# EAGLE design KidMotorV1.1 (EAGLE 9.2.1)
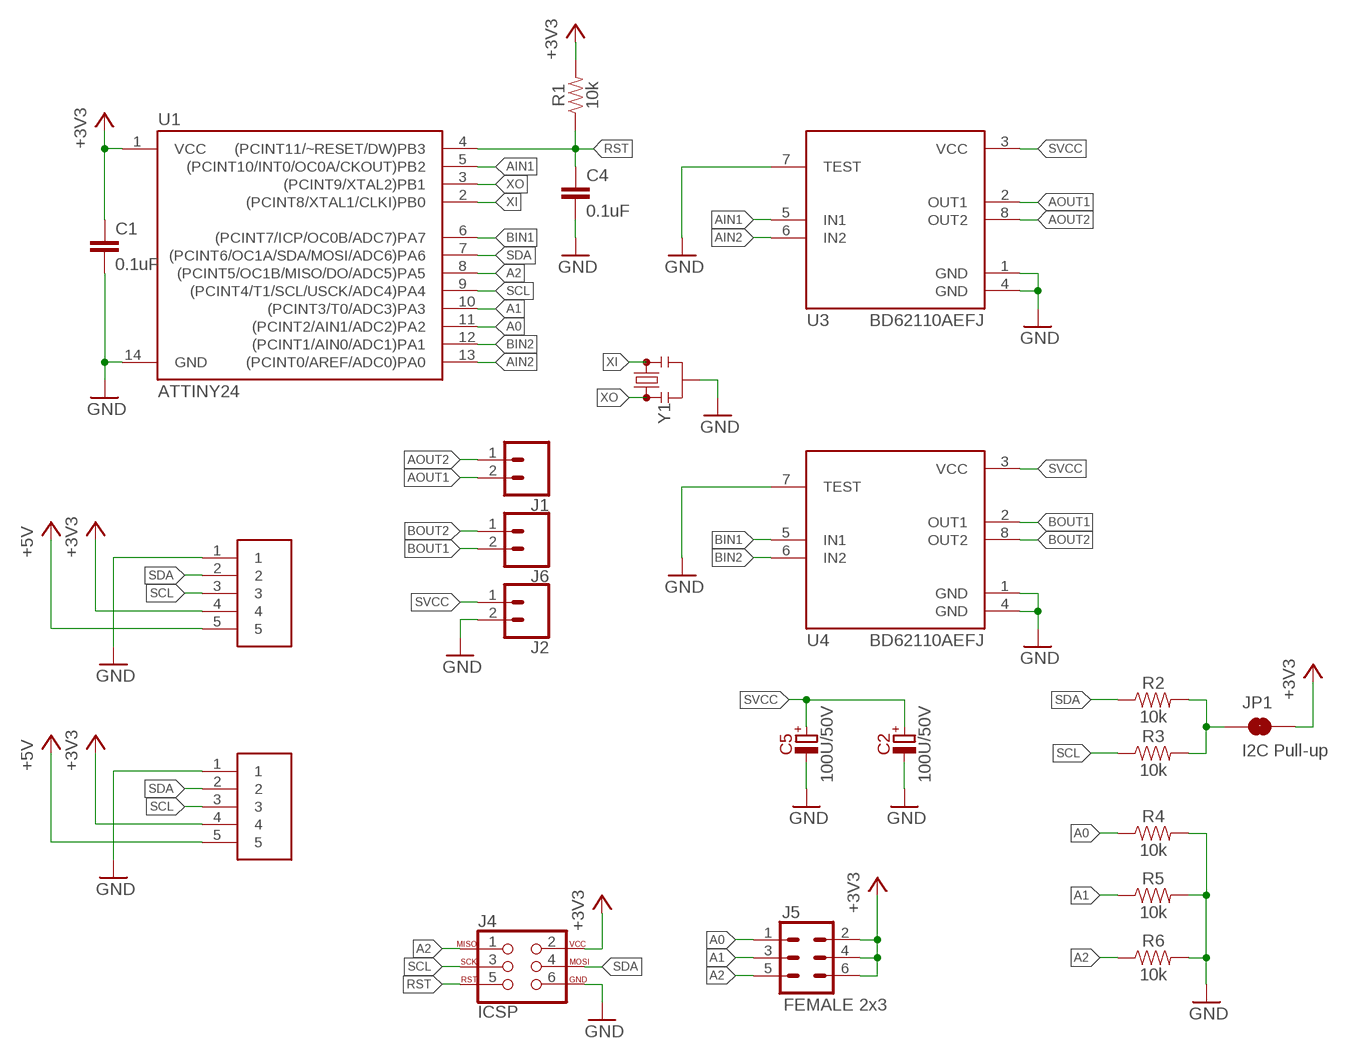
[diagram p0: schematic, sheet 1]

## Parts
C1  0.1uF  1.0UF-0603-16V-10%  [0603]
C2  100U/50V  [E3,5-8]
C4  0.1uF  0.1UF-0603-25V-5%  [0603]
C5  100U/50V  [E3,5-8]
J1  CONN_025MM  [SCREWTERMINAL-5MM-2]
J2  CONN_025MM  [SCREWTERMINAL-5MM-2]
J4  ICSP  AVR_SPI_PROG_3X2PTH  [2X3]
J5  FEMALE 2x3  CONN_03X2FEMALE  [2X3]
J6  CONN_025MM  [SCREWTERMINAL-5MM-2]
JP1  I2C Pull-up  JUMPER-SMT_2_NC_TRACE_SILK  [SMT-JUMPER_2_NC_TRACE_SILK]
R1  10k  10KOHM-0603-1/10W-1%  [0603]
R2  10k  10KOHM-0603-1/10W-1%  [0603]
R3  10k  10KOHM-0603-1/10W-1%  [0603]
R4  10k  10KOHM-0603-1/10W-1%  [0603]
R5  10k  10KOHM-0603-1/10W-1%  [0603]
R6  10k  10KOHM-0603-1/10W-1%  [0603]
U1  ATTINY24  ATTINY84  [SO14]
U3  BD62110AEFJ  [HTSOP-J8]
U4  BD62110AEFJ  [HTSOP-J8]
U$2  JST5PIN  [JST5PIN]
U$5  JST5PIN  [JST5PIN]
Y1  RESONATORSMD-3.2X1.3  [RESONATOR-SMD-3.2X1.3]

## Nets
+3V3: C1.1 J4.2 J5.2 J5.4 J5.6 JP1.2 R1.2 U1.1(VCC) U$2.4 U$5.4
+5V: U$2.5 U$5.5
A0: J5.1 R4.1 U1.11((PCINT2/AIN1/ADC2)PA2)
A1: J5.3 R5.1 U1.10((PCINT3/T0/ADC3)PA3)
A2: J4.1 J5.5 R6.1 U1.8((PCINT5/OC1B/MISO/DO/ADC5)PA5)
AIN1: U1.5((PCINT10/INT0/OC0A/CKOUT)PB2) U3.5(IN1)
AIN2: U1.13((PCINT0/AREF/ADC0)PA0) U3.6(IN2)
AOUT1: J1.2 U3.2(OUT1)
AOUT2: J1.1 U3.8(OUT2)
BIN1: U1.6((PCINT7/ICP/OC0B/ADC7)PA7) U4.5(IN1)
BIN2: U1.12((PCINT1/AIN0/ADC1)PA1) U4.6(IN2)
BOUT1: J6.2 U4.2(OUT1)
BOUT2: J6.1 U4.8(OUT2)
GND: C1.2 C2.- C4.2 C5.- J2.2 J4.6 R4.2 R5.2 R6.2 U1.14(GND) U3.1(GND) U3.4(GND) U3.7(TEST) U4.1(GND) U4.4(GND) U4.7(TEST) U$2.1 U$5.1 Y1.2
N$2: JP1.1 R2.2 R3.2
RST: C4.1 J4.5 R1.1 U1.4((PCINT11/~RESET/DW)PB3)
SCL: J4.3 R3.1 U1.9((PCINT4/T1/SCL/USCK/ADC4)PA4) U$2.3 U$5.3
SDA: J4.4 R2.1 U1.7((PCINT6/OC1A/SDA/MOSI/ADC6)PA6) U$2.2 U$5.2
SVCC: C2.+ C5.+ J2.1 U3.3(VCC) U4.3(VCC)
XI: U1.2((PCINT8/XTAL1/CLKI)PB0) Y1.3
XO: U1.3((PCINT9/XTAL2)PB1) Y1.1

## Library data of the parts
C1 = SparkFun-Capacitors:1.0UF: 1µF ceramic capacitors A capacitor is a passive two-terminal electrical component used to store electrical energy temporarily in an electric field.; PROD_ID: CAP-00868; VALUE: 1.0uF
C2 C5 = capacitors-electrolytic:?; MOUSER: 647-UKA1H101MPD
C4 = SparkFun-Capacitors:0.1UF: 0.1µF ceramic capacitors A capacitor is a passive two-terminal electrical component used to store electrical energy temporarily in an electric field.; PROD_ID: CAP-08604
J1 J2 J6 = SparkFun-Connectors:CONN_02: Multi connection point. Often used as Generic Header-pin footprint for 0.1 inch spaced/style header connections On any of the 0.1 inch spaced packages, you can populate with these: Break Away Headers - Straight <https://www.sparkfun.com/products/116> (PRT-00116) Break Away Male Headers - Right Angle <https://www.sparkfun.com/products/553> (PRT-00553) Female Headers <https://www.sparkfun.com/products/115> (PRT-00115) Break Away Headers - Machine Pin <https://www.sparkfun.com/products/117> (PRT-00117) Break Away Female Headers - Swiss Machine Pin <https://www.sparkfun.com/products/743> (PRT-00743) For SCREWTERMINALS and SPRING TERMINALS visit here: Screw Terimnals on SparkFun.com <https://www.sparkfun.com/search/results?term=Screw+Terminals> (5mm/3.5mm/2.54mm spacing) This device is also useful as a general connection point to wire up your design to another part of your project. Our various solder wires solder well into these plated through hole pads. Hook-Up Wire - Assortment (Stranded, 22 AWG) <https://www.sparkfun.com/products/11375> (PRT-11375) Hook-Up Wire - Assortment (Solid Core, 22 AWG) <https://www.sparkfun.com/products/11367> (PRT-11367) View the entire wire category on our website here <https://www.sparkfun.com/categories/141> Special notes: Molex polarized connector foot print use with: PRT-08233 with associated crimp pins and housings. 2.54_SCREWTERM for use with PRT-10571. 3.5mm Screw Terminal footprints for PRT-08084 5mm Screw Terminal footprints for use with PRT-08432; SF_SKU: PRT-08432
J4 = SparkFun-Connectors:AVR_SPI_PROG_3X2: AVR ISP 6 Pin This is the reduced ISP connector for AVR programming. Common on Arduino. This footprint will take up less PCB space and can be used with a 10-pin to 6-pin adapter such as SKU: BOB-08508 **Special note about "TEST_POINT" package. The stop mask is on the top side, so if you want your programming test points to be on the bottom of your board, make sure to place this package on the bottom side of the board. This also ensure that the orientation to program from the bottom side will be correct. SparkFun Products: SparkFun ISP Pogo Adapter <https://www.sparkfun.com/products/11591> - NS Tiny AVR Programmer <https://www.sparkfun.com/products/11801> -PTH
J5 = SparkFun-Connectors:CONN_03X2: Multi connection point. Often used as Generic Header-pin footprint for 0.1 inch spaced/style header connections You can populate with any combo of single row headers, but if you'd like an exact match, check these: Header - 2x3 (Male, 0.1") <https://www.sparkfun.com/products/12807> (PRT-12807) Header - 2x3 (Female, 0.1") <https://www.sparkfun.com/products/13010> (PRT-13010) 2x3 Pin Shrouded Header <https://www.sparkfun.com/products/10877> (PRT-10877) On any of the 0.1 inch spaced packages, you can populate with these: Break Away Headers - Straight <https://www.sparkfun.com/products/116> (PRT-00116) Break Away Male Headers - Right Angle <https://www.sparkfun.com/products/553> (PRT-00553) Female Headers <https://www.sparkfun.com/products/115> (PRT-00115) Break Away Headers - Machine Pin <https://www.sparkfun.com/products/117> (PRT-00117) Break Away Female Headers - Swiss Machine Pin <https://www.sparkfun.com/products/743> (PRT-00743) Special note: the shrouded connector mates well with our 3x2 ribbon cables: Ribbon Crimp Connector - 6-pin (2x3, Female) <https://www.sparkfun.com/products/10651> (PRT-10651) Ribbon Cable - 6 wire (15ft) <https://www.sparkfun.com/products/10646> (PRT-10646); PROD_ID: CONN-11566
JP1 = SparkFun-Jumpers:JUMPER-SMT_2_NC_TRACE: Normally closed trace jumper This jumper has a trace between two pads so it's normally closed (NC). Use a razor knife to open the connection. For best results follow the IPC guidelines for cutting traces: Cutout at least 0.063 mm (0.005 in). Remove all loose material to clean up the cut area. Seal the cut with an approved epoxy. Reapply solder to reclose the connection.
R1-R6 = SparkFun-Resistors:10KOHM: 10kΩ resistor A resistor is a passive two-terminal electrical component that implements electrical resistance as a circuit element. Resistors act to reduce current flow, and, at the same time, act to lower voltage levels within circuits. - Wikipedia; PROD_ID: RES-00824
U1 = SparkFun-IC-Microcontroller:ATTINY84: Atmel 14-pin 2/4/8kB flash uC Datasheet <https://cdn.sparkfun.com/datasheets/Widgets/doc8006.pdf> SparkFun Products Tiny AVR Programmer <https://www.sparkfun.com/products/11801> (PGM-11801) SparkFun Servo Trigger - Continuous Rotation <https://www.sparkfun.com/products/13872> (WIG-13872) SparkFun Servo Trigger <https://www.sparkfun.com/products/13118> (WIG-13118); PROD_ID: IC-11285; VALUE: ATTINY84
U3 U4 = IOXhop-IC:BD62110AEFJ
U$2 U$5 = IOXhop Connector:JST5PIN
Y1 = SparkFun-Clocks:RESONATOR: Resonators (Generic) Ceramic resonators are clock-generating components, often used to control timing in microcontrollers. They usually have 3 pins: two pins for oscillation, and one pin for ground. Compared to crystals, resonators have worse tolerance, but are usually much cheaper. Plus, they have built-in load capacitors! These devices are used on boards like the Arduino Pro 8MHz <https://www.sparkfun.com/products/11114> and Arduino Pro 16MHz <https://www.sparkfun.com/products/11113>.

## Board
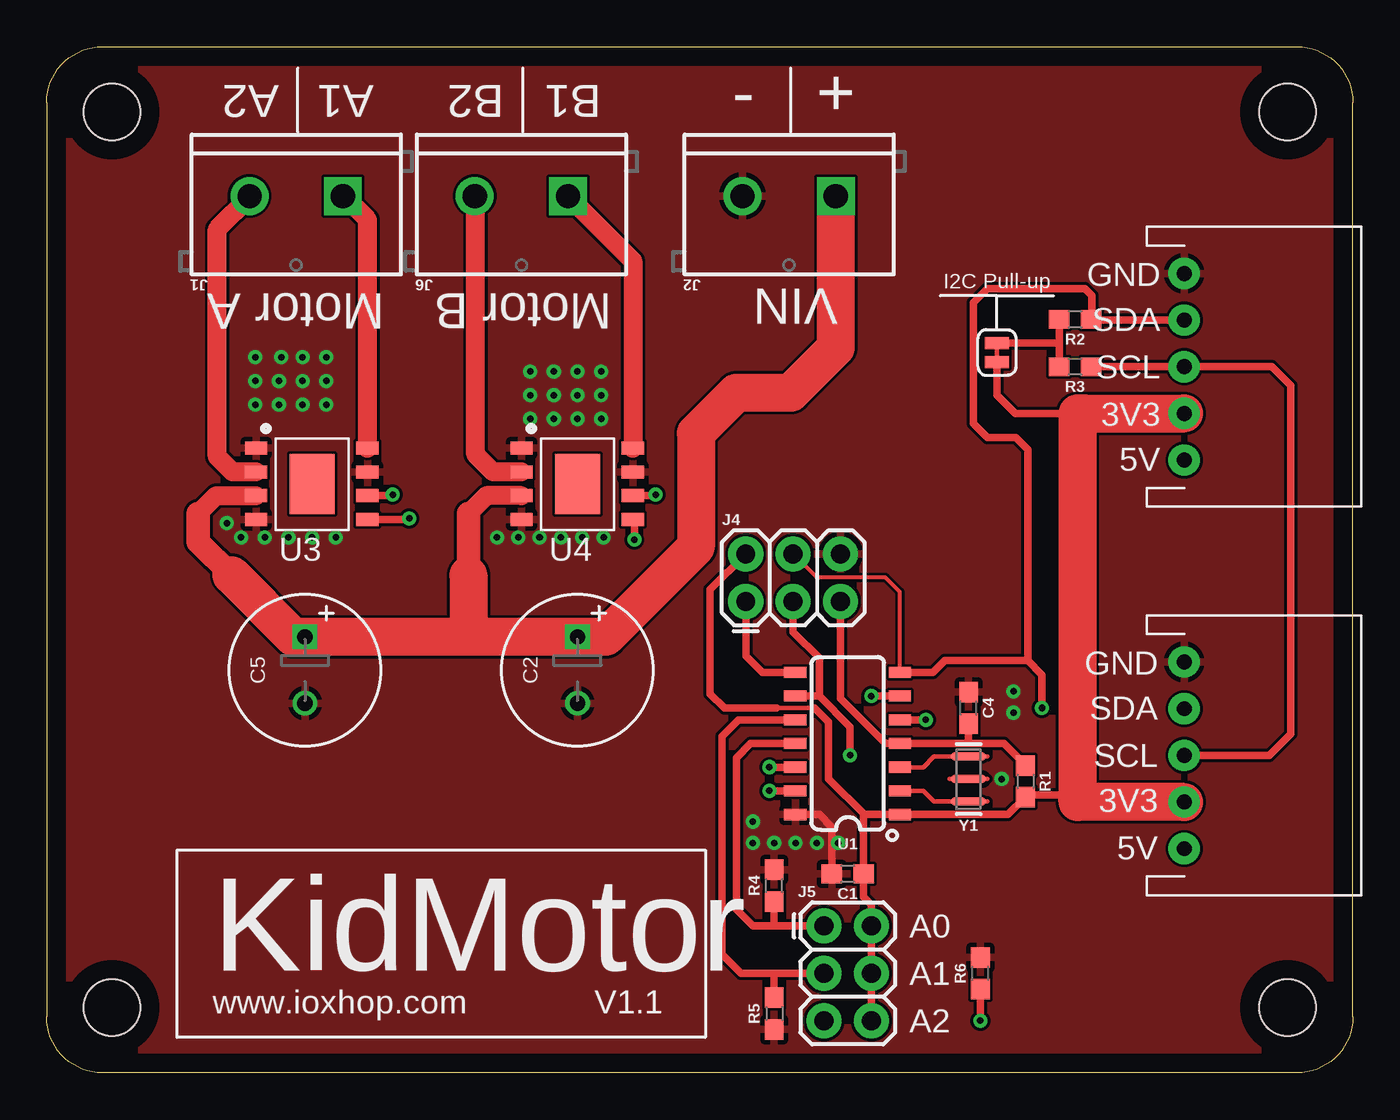
[diagram p1: board, top side]
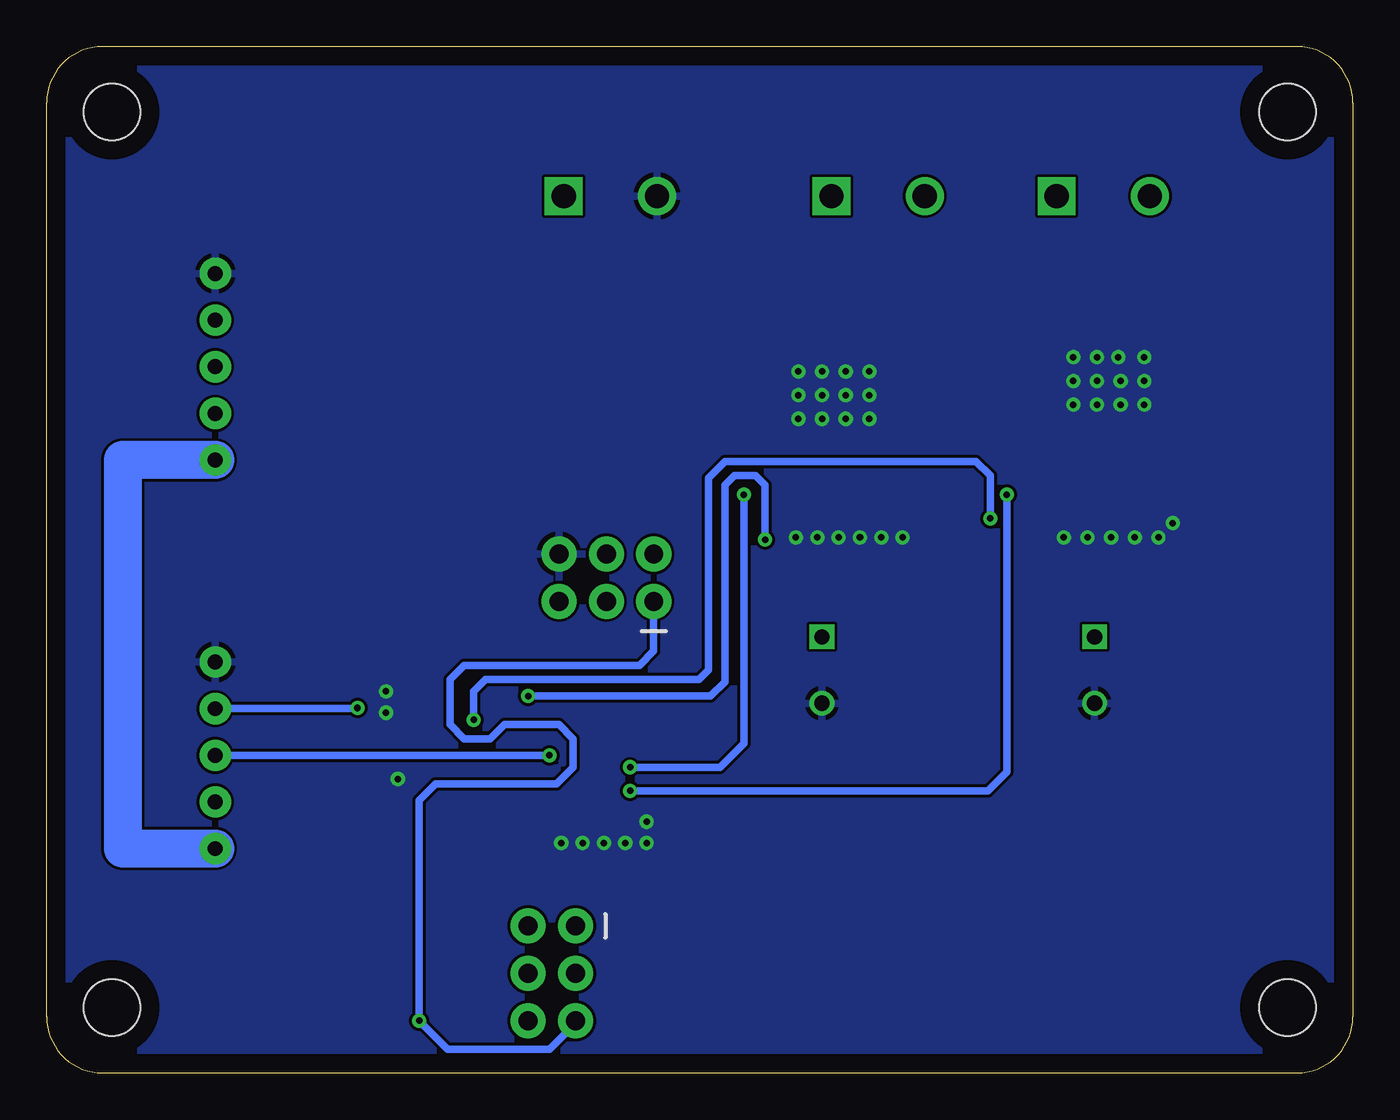
[diagram p2: board, bottom side, seen from below]

Size 70 x 55 mm. Coordinates in mm from the lower left corner, seen from the top.
Outline: 70,3 70,52 arc90 67,55 3,55 arc90 0,52 0,3 arc90 3,0 67,0 arc90 70,3
Copper layers (1*16): Top 0.035mm / dielectric 1.5mm / Bottom 0.035mm
Design rules "default *": minimum track width 6mil, minimum drill 0.35mm, track to track 6mil, track to pad 6mil, pad to pad 6mil, via to via 6mil, smd to smd 6mil, copper to edge 40mil, drill to drill 6mil, minimum pad ring 10mil, minimum via ring 8mil, stop-mask expansion 4mil, vias tented up to drill 32mil, thermal gap 10mil
Holes 3.05 mm at 3.5,3.5 3.5,51.5 66.5,3.5 66.5,51.5

### Footprints (pad centres in the part's own frame; a part is rotated, then mirrored left to right if it is on the bottom)
0603 = smd 1.1 x 1: 1 -0.85,0; 2 0.85,0
E3,5-8 = drill 0.813 square: + -1.778,0 | drill 0.813: - 1.778,0
SCREWTERMINAL-5MM-2 = drill 1.3 pad 2.032 square: 1 0,0 | drill 1.3 pad 2.032: 2 5,0
2X3 = drill 1.016 pad 1.88: 1 0,0; 2 0,2.54; 3 2.54,0; 4 2.54,2.54; 5 5.08,0; 6 5.08,2.54
SMT-JUMPER_2_NC_TRACE_SILK = smd 0.635 x 1.27: 1 -0.508,0; 2 0.508,0
SO14 = smd 0.6 x 1.2: 1 -3.175,-2.8; 2 -1.905,-2.8; 3 -0.635,-2.8; 4 0.635,-2.8; 5 1.905,-2.8; 6 3.175,-2.8; 7 4.445,-2.8; 8 4.445,2.8; 9 3.175,2.8; 10 1.905,2.8; 11 0.635,2.8; 12 -0.635,2.8; 13 -1.905,2.8; 14 -3.175,2.8
HTSOP-J8 = smd 1.2 x 0.7: 1 -2.999,1.981; 2 -2.999,0.711; 3 -2.999,-0.559; 4 -2.999,-1.829; 5 2.97,-1.829; 6 2.97,-0.559; 7 2.97,0.711; 8 2.97,1.981 | smd 2.4 x 3.2: P$1 -0.001,0.061
JST5PIN = drill 0.8 pad 1.676: 1 0,5; 2 0,2.5; 3 0,0; 4 0,-2.5; 5 0,-5
RESONATOR-SMD-3.2X1.3 = smd 0.45 x 1.905: 1 -1.2,0; 2 0,0; 3 1.2,0

### Placement (x,y rotation side)
C1  42.93,10.67 180 top
C2  28.45,21.59 270 top
C4  49.4,19.56 90 top
C5  13.84,21.59 270 top
J1  15.88,46.99 180 top
J2  42.29,46.99 180 top
J4  37.47,25.27 0 top
J5  41.66,7.87 270 top
J6  27.94,46.99 180 top
JP1  50.93,38.61 270 top
R1  52.45,15.62 270 top
R2  55.12,40.39 180 top
R3  55.12,37.85 180 top
R4  38.99,10.03 90 top
R5  38.99,3.17 270 top
R6  50.04,5.33 90 top
U1  42.93,17.02 90 top
U3  14.22,31.5 0 top
U4  28.45,31.5 0 top
U$2  60.96,37.85 0 top
U$5  60.96,17.02 0 top
Y1  49.4,15.75 270 top

### Tracks (layer width: path | path; a pad name or v marks a point on that pad's centre or on a via)
+3V3
  Top 0.254: 41.15,19.56 39.12,19.56
  Top 0.406: 55.24,14.9 52.58,14.9 R1.2 51.52,13.84 U1.1 43.86,13.84 43.84,13.82 | JP1.2 50.93,36.34 51.14,36.11 51.9,35.35 55.63,35.35 | 43.84,13.82 41.91,15.75 41.91,18.8 41.15,19.56 | 39.12,19.56 36.32,19.56 35.56,20.32 35.56,25.91 J4.2 | 43.84,13.82 43.78,13.76 C1.1 43.78,9.44 44.2,9.02 J5.2 J5.4 J5.6
  Top 2.032: U$5.4 55.24,14.52 55.24,14.9 55.24,35.35 55.63,35.35 U$2.4
+5V
  Bottom 2.032: U$2.5 65.91,32.85 65.91,12.02 U$5.5
A0
  Top 0.406: U1.11 37.72,17.65 36.96,16.89 36.96,8.76 37.85,7.87 38.99,7.87 | 38.99,7.87 J5.1 | R4.1 38.99,7.87
A1
  Top 0.406: J5.3 38.99,5.33 | 38.99,5.33 37.21,5.33 36.2,6.35 36.2,18.03 37.08,18.92 U1.10 | R5.1 38.99,5.33
A2  (via drill 0.35)
  Top 0.406: J4.1 37.47,22.35 38.35,21.46 U1.8 | R6.1 v50.04,2.79
  Bottom 0.406: J5.5 41.66,2.67 43.05,1.27 48.51,1.27 v50.04,2.79 50.04,14.61 49.15,15.49 42.67,15.49 41.78,16.38 41.78,17.91 42.55,18.67 45.47,18.67 46.23,17.91 47.62,17.91 48.39,18.67 48.39,21.08 47.62,21.84 38.23,21.84 37.47,22.61 J4.1
AIN1  (via drill 0.35)
  Top 0.406: U3.5 19.38,29.67 v19.43,29.72 | v47.12,18.92 U1.5
  Bottom 0.406: v19.43,29.72 19.43,32 20.19,32.77 33.66,32.77 34.54,31.88 34.54,21.59 35.05,21.08 46.48,21.08 47.12,20.45 v47.12,18.92
AIN2  (via drill 0.35)
  Top 0.406: U3.6 18.49,30.94 v18.54,30.99 | v38.73,15.11 U1.13
  Bottom 0.406: v18.54,30.99 18.54,16.13 19.56,15.11 v38.73,15.11
AOUT1
  Top 1.016: U3.2 9.96,32.21 9.14,33.02 9.14,45.21 10.88,46.94 J1.2
AOUT2
  Top 1.016: U3.8 17.19,45.72 15.92,46.99 J1.1
BIN1  (via drill 0.35)
  Top 0.406: U4.5 31.5,29.59 v31.5,28.57 | v44.2,20.19 U1.6
  Bottom 0.406: v31.5,28.57 31.5,31.5 32,32 33.15,32 33.66,31.5 33.66,20.95 34.42,20.19 v44.2,20.19
BIN2  (via drill 0.35)
  Top 0.406: U4.6 32.59,30.94 v32.64,30.99 | v38.73,16.38 U1.12
  Bottom 0.406: v32.64,30.99 32.64,17.65 33.91,16.38 v38.73,16.38
BOUT1
  Top 1.016: U4.2 23.93,32.21 22.99,33.15 22.99,46.94 J6.2
BOUT2
  Top 1.016: U4.8 31.42,43.51 J6.1
GND  (via drill 0.35)
  Top 0.406: C1.2 42.08,13.17 41.4,13.84 U1.14
  other vias: 11.18,35.81 12.45,35.81 13.72,35.81 14.99,35.81 12.45,37.08 13.72,37.08 14.99,37.08 9.65,29.46 10.41,28.7 11.68,28.7 12.95,28.7 14.22,28.7 15.49,28.7 28.45,35.05 27.18,35.05 29.72,35.05 29.72,36.32 28.45,36.32 27.18,36.32 27.18,37.59 28.45,37.59 24.13,28.7 25.27,28.7 26.42,28.7 27.56,28.7 28.7,28.7 29.84,28.7 51.82,19.3 51.82,20.45 51.18,15.75 40.13,12.32 41.27,12.32 42.42,12.32 38.99,12.32 37.85,12.32 37.85,13.46 11.18,37.08 25.91,35.05 25.91,36.32 29.72,37.59 25.91,37.59 14.99,38.35 13.72,38.35 12.57,38.35 11.18,38.35
  pour Bottom: -0.13,-0.13 70.1,-0.13 70.1,1.78 70.1,55.12 -0.13,55.12
  pour Top: -0.25,55.24 70.23,55.24 70.23,-0.25 -0.25,-0.25
N$2
  Top 0.406: JP1.1 54.23,39.12 54.27,39.16 | 54.27,39.16 R2.2 | R3.2 54.27,39.16
RST
  Top 0.406: 49.4,17.65 U1.4 44.96,17.65 42.55,20.07 J4.5 | 49.4,17.65 51.31,17.65 52.45,16.51 R1.1 | C4.1 49.4,17.65
SCL  (via drill 0.35)
  Top 0.406: U$5.3 65.53,17.02 66.67,18.16 66.67,36.83 65.66,37.85 U$2.3 R3.1 | v43.05,17.02 43.05,18.54 41.4,20.19 | 41.4,20.19 U1.9 | J4.3 40.01,23.62 41.4,22.23 41.4,20.19
  Bottom 0.406: U$5.3 v43.05,17.02
SDA  (via drill 0.35)
  Top 0.203: U1.7 45.73,25.77 44.96,26.54 41.27,26.54 J4.4
  Top 0.406: U$2.2 56.01,40.35 | 56.01,40.35 R2.1 | U1.7 47.5,21.46 48.13,22.1 52.58,22.1 | 52.58,22.1 53.34,21.34 v53.34,19.56 | 52.58,22.1 52.58,33.4 51.94,34.04 50.42,34.04 49.66,34.8 49.66,41.27 50.42,42.04 55.63,42.04 56.01,41.66 56.01,40.35
  Bottom 0.406: v53.34,19.56 53.38,19.52 U$5.2
SVCC
  Top 1.016: 8.13,29.97 9.09,30.94 U3.3 | U4.3 23.57,30.94 22.61,29.97
  Top 1.27: 9.91,26.67 8.13,28.45 8.13,29.97 | 22.61,29.97 22.61,26.67
  Top 2.032: J2.1 42.29,38.86 39.88,36.45 36.96,36.45 34.8,34.29 34.8,28.19 29.97,23.37 C2.+ 22.48,23.37 | 22.48,23.37 C5.+ 13.21,23.37 9.91,26.67 | 22.61,26.67 22.61,23.5 22.48,23.37
XI
  Top 0.254: Y1.3 47.55,14.55 46.99,15.11 U1.2
XO
  Top 0.254: Y1.1 47.55,16.95 46.99,16.38 U1.3

### Text on the board
tPlace: A0 | A1 | A2
tNames: A2 | A1 | B2 | B1 | - | + | GND | Motor A | Motor B | VIN | I2C Pull-up | SDA | SCL | 3V3 | 5V | GND | SDA | SCL | 3V3 | 5V | KidMotor | www.ioxhop.com | V1.1